# Altium schematic sheet Communication.SchDoc
size A4; SheetNumber: 2; SheetTotal: 2
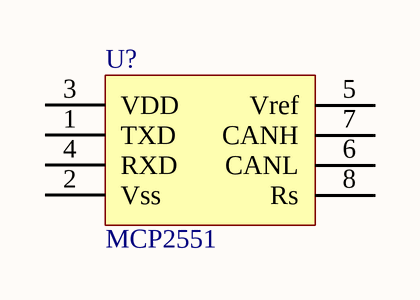
[diagram p0: Communication.SchDoc]

## Parts
U?  MCP2551  [SO-8N]

## Nets

Not connected (* = marked no-connect by the designer): U? 1(TXD) 2(Vss) 3(VDD) 4(RXD) 5(Vref) 6(CANL) 7(CANH) 8(Rs)

## Library data of the parts
U? = MCP2551: CAN收发器; 1.库作者: 冰凌猫; 2.库版本: v2.0 (2021.03.30); 3.交流分享: Q群514746572,开源更新,欢迎一起交流学习PCB设计; 4.作者声明: 旨为整合最全库集,欢迎转载,禁止商用！-冰凌猫; 5.备注说明: 该库已二次整合过网上各热销库,基本最全,无需重复搜购安装